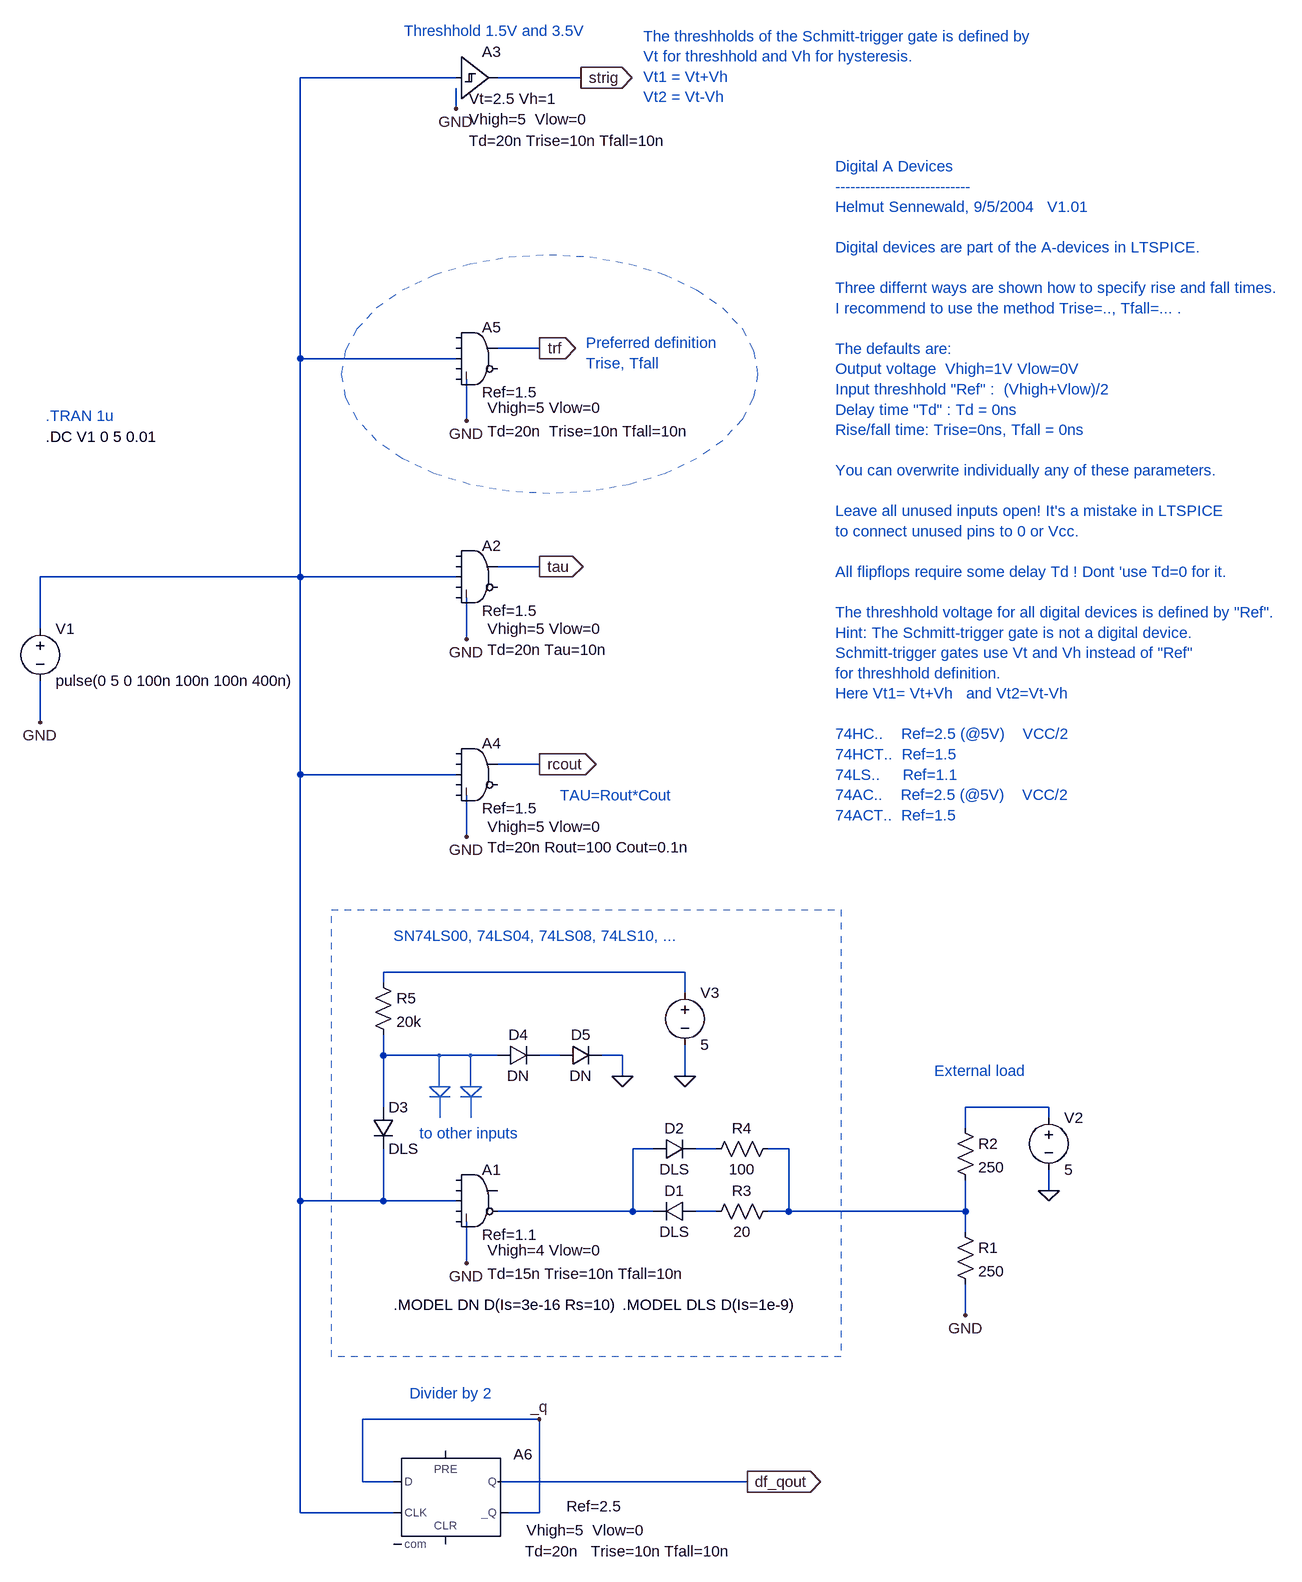
[diagram p0: schematic DIGITAL_A_DEVICES_1.asc]
DIGITAL_A_DEVICES_1.asc, the LTspice schematic file:
Version 4
SHEET 1 3000 2120
WIRE 1632 1584 1632 1648
WIRE 1680 1568 1888 1568
WIRE 976 816 976 752
WIRE 976 672 976 592
WIRE 1376 1552 1504 1552
WIRE 2400 1568 2400 1600
WIRE 2400 1680 2400 1728
WIRE 1632 624 1632 688
WIRE 1680 576 1744 576
WIRE 1616 592 1376 592
WIRE 1376 592 1376 896
WIRE 1376 592 1376 256
WIRE 1376 -176 1616 -176
WIRE 1680 -176 1808 -176
WIRE 1616 -160 1616 -128
WIRE 2528 1504 2528 1536
WIRE 2528 1424 2528 1408
WIRE 2528 1408 2400 1408
WIRE 2400 1408 2400 1440
WIRE 2400 1520 2400 1568
WIRE 1632 928 1632 992
WIRE 1680 880 1744 880
WIRE 1616 896 1376 896
WIRE 1376 896 1376 1552
WIRE 1632 288 1632 352
WIRE 1680 240 1744 240
WIRE 1376 256 1616 256
WIRE 1376 256 1376 -176
WIRE 2096 1568 2128 1568
WIRE 1984 1568 2016 1568
WIRE 1984 1472 2016 1472
WIRE 2128 1472 2128 1568
WIRE 2128 1568 2400 1568
WIRE 2096 1472 2128 1472
WIRE 1920 1472 1888 1472
WIRE 1888 1472 1888 1568
WIRE 1888 1568 1920 1568
WIRE 1376 592 976 592
WIRE 1504 1472 1504 1552
WIRE 1504 1552 1616 1552
WIRE 1504 1408 1504 1328
WIRE 1504 1216 1504 1200
WIRE 1968 1200 1968 1232
WIRE 1968 1312 1968 1360
WIRE 1504 1200 1968 1200
WIRE 1520 2032 1376 2032
WIRE 1376 2032 1376 1552
WIRE 1520 1984 1472 1984
WIRE 1472 1984 1472 1888
WIRE 1472 1888 1744 1888
WIRE 1744 1888 1744 2032
WIRE 1680 1984 2064 1984
WIRE 1744 2032 1696 2032
WIRE 1840 1328 1872 1328
WIRE 1776 1328 1744 1328
WIRE 1680 1328 1504 1328
WIRE 1504 1328 1504 1296
WIRE 1872 1328 1872 1360
FLAG 1632 1648 GND
FLAG 976 816 GND
FLAG 2400 1728 GND
FLAG 1632 688 GND
FLAG 1616 -128 GND
FLAG 2528 1536 0
FLAG 1632 992 GND
FLAG 1744 576 tau
IOPIN 1744 576 Out
FLAG 1744 880 rcout
IOPIN 1744 880 Out
FLAG 1632 352 GND
FLAG 1744 240 trf
IOPIN 1744 240 Out
FLAG 1808 -176 strig
IOPIN 1808 -176 Out
FLAG 1968 1360 0
FLAG 2064 1984 df_qout
IOPIN 2064 1984 Out
FLAG 1744 1888 _q
FLAG 1872 1360 0
SYMBOL digital\\and 1648 1488 R0
WINDOW 39 16 176 Left 0
WINDOW 123 16 140 Left 0
SYMATTR SpiceLine Td=15n Trise=10n Tfall=10n
SYMATTR Value2 Vhigh=4 Vlow=0
SYMATTR InstName A1
SYMATTR Value Ref=1.1
SYMATTR SpiceLine2 tripdt=5n
SYMBOL voltage 976 656 R0
SYMATTR InstName V1
SYMATTR Value pulse(0 5 0 100n 100n 100n 400n)
SYMBOL res 2384 1584 R0
SYMATTR InstName R1
SYMATTR Value 250
SYMBOL digital\\and 1648 528 R0
WINDOW 39 16 176 Left 0
WINDOW 123 16 144 Left 0
SYMATTR SpiceLine Td=20n Tau=10n
SYMATTR Value2 Vhigh=5 Vlow=0
SYMATTR SpiceLine2 tripdt=5n
SYMATTR InstName A2
SYMATTR Value Ref=1.5
SYMBOL digital\\schmtbuf 1616 -240 R0
WINDOW 3 20 96 Left 0
WINDOW 123 20 128 Left 0
WINDOW 39 20 161 Left 0
SYMATTR Value Vt=2.5 Vh=1
SYMATTR Value2 Vhigh=5  Vlow=0
SYMATTR SpiceLine Td=20n Trise=10n Tfall=10n
SYMATTR InstName A3
SYMATTR SpiceLine2 tripdt=5n
SYMBOL voltage 2528 1408 R0
SYMATTR InstName V2
SYMATTR Value 5
SYMBOL res 2384 1424 R0
SYMATTR InstName R2
SYMATTR Value 250
SYMBOL digital\\and 1648 832 R0
WINDOW 39 16 176 Left 0
WINDOW 123 16 144 Left 0
SYMATTR SpiceLine Td=20n Rout=100 Cout=0.1n
SYMATTR Value2 Vhigh=5 Vlow=0
SYMATTR SpiceLine2 tripdt=5n
SYMATTR InstName A4
SYMATTR Value Ref=1.5
SYMBOL digital\\and 1648 192 R0
WINDOW 39 16 176 Left 0
WINDOW 123 16 140 Left 0
SYMATTR SpiceLine Td=20n  Trise=10n Tfall=10n
SYMATTR Value2 Vhigh=5 Vlow=0
SYMATTR InstName A5
SYMATTR Value Ref=1.5
SYMATTR SpiceLine2 tripdt=5n
SYMBOL res 2000 1584 R270
WINDOW 0 32 56 VTop 0
WINDOW 3 0 56 VBottom 0
SYMATTR InstName R3
SYMATTR Value 20
SYMBOL diode 1984 1552 R90
WINDOW 0 0 32 VBottom 0
WINDOW 3 32 32 VTop 0
SYMATTR InstName D1
SYMATTR Value DLS
SYMBOL diode 1920 1488 R270
WINDOW 0 32 32 VTop 0
WINDOW 3 0 32 VBottom 0
SYMATTR InstName D2
SYMATTR Value DLS
SYMBOL res 2000 1488 R270
WINDOW 0 32 56 VTop 0
WINDOW 3 0 56 VBottom 0
SYMATTR InstName R4
SYMATTR Value 100
SYMBOL voltage 1968 1216 R0
SYMATTR InstName V3
SYMATTR Value 5
SYMBOL diode 1488 1408 R0
SYMATTR InstName D3
SYMATTR Value DLS
SYMBOL Digital\\dflop 1600 1936 R0
WINDOW 3 186 86 Left 0
WINDOW 123 124 123 Left 0
WINDOW 39 122 155 Left 0
SYMATTR Value Ref=2.5
SYMATTR Value2 Vhigh=5  Vlow=0
SYMATTR SpiceLine Td=20n   Trise=10n Tfall=10n
SYMATTR InstName A6
SYMATTR SpiceLine2 tripdt=5n
SYMBOL res 1488 1200 R0
SYMATTR InstName R5
SYMATTR Value 20k
SYMBOL diode 1680 1344 R270
WINDOW 0 32 32 VTop 0
WINDOW 3 0 32 VBottom 0
SYMATTR InstName D4
SYMATTR Value DN
SYMBOL diode 1776 1344 R270
WINDOW 0 32 32 VTop 0
WINDOW 3 0 32 VBottom 0
SYMATTR InstName D5
SYMATTR Value DN
TEXT 984 344 Left 0 ;.TRAN 1u
TEXT 1776 928 Left 0 ;TAU=Rout*Cout
TEXT 1536 -248 Left 0 ;Threshhold 1.5V and 3.5V
TEXT 1872 1712 Left 0 !.MODEL DLS D(Is=1e-9)
TEXT 1520 1144 Left 0 ;SN74LS00, 74LS04, 74LS08, 74LS10, ...
TEXT 1816 232 Left 0 ;Preferred definition\nTrise, Tfall
TEXT 1904 -240 Left 0 ;The threshholds of the Schmitt-trigger gate is defined by \nVt for threshhold and Vh for hysteresis.\nVt1 = Vt+Vh\nVt2 = Vt-Vh
TEXT 2352 1352 Left 0 ;External load
TEXT 2200 -40 Left 0 ;Digital A Devices\n---------------------------\nHelmut Sennewald, 9/5/2004   V1.01\n \nDigital devices are part of the A-devices in LTSPICE.\n \nThree differnt ways are shown how to specify rise and fall times.\nI recommend to use the method Trise=.., Tfall=... .\n \nThe defaults are:\nOutput voltage  Vhigh=1V Vlow=0V\nInput threshhold "Ref" :  (Vhigh+Vlow)/2\nDelay time "Td" : Td = 0ns\nRise/fall time: Trise=0ns, Tfall = 0ns\n \nYou can overwrite individually any of these parameters.\n \nLeave all unused inputs open! It's a mistake in LTSPICE \nto connect unused pins to 0 or Vcc.\n \nAll flipflops require some delay Td ! Dont 'use Td=0 for it.\n \nThe threshhold voltage for all digital devices is defined by "Ref".\nHint: The Schmitt-trigger gate is not a digital device.\nSchmitt-trigger gates use Vt and Vh instead of "Ref" \nfor threshhold definition.\nHere Vt1= Vt+Vh   and Vt2=Vt-Vh\n \n74HC..    Ref=2.5 (@5V)    VCC/2  \n74HCT..  Ref=1.5\n74LS..     Ref=1.1\n74AC..    Ref=2.5 (@5V)    VCC/2\n74ACT..  Ref=1.5
TEXT 1544 1848 Left 0 ;Divider by 2
TEXT 1560 1448 Left 0 ;to other inputs
TEXT 984 376 Left 0 !.DC V1 0 5 0.01
TEXT 1520 1712 Left 0 !.MODEL DN D(Is=3e-16 Rs=10)
LINE Normal 1607 1376 1575 1376
LINE Normal 1591 1392 1607 1376
LINE Normal 1575 1376 1591 1392
LINE Normal 1575 1376 1575 1376
LINE Normal 1607 1392 1575 1392
LINE Normal 1590 1376 1590 1328
LINE Normal 1591 1424 1591 1392
LINE Normal 1655 1376 1623 1376
LINE Normal 1639 1392 1655 1376
LINE Normal 1623 1376 1639 1392
LINE Normal 1623 1376 1623 1376
LINE Normal 1655 1392 1623 1392
LINE Normal 1638 1376 1638 1328
LINE Normal 1639 1424 1639 1392
RECTANGLE Normal 2208 1792 1424 1104 2
CIRCLE Normal 2080 464 1440 96 2
CIRCLE Normal 1590 1328 1590 1328
CIRCLE Normal 1592 1326 1588 1330
CIRCLE Normal 1638 1328 1638 1328
CIRCLE Normal 1640 1326 1636 1330

The netlist it stands for:
* DIGITAL_A_DEVICES_1.asc
A1 GND GND N002 GND GND N001 GND GND AND Ref=1.1 Vhigh=4 Vlow=0 Td=15n Trise=10n Tfall=10n tripdt=5n
V1 N002 GND pulse(0 5 0 100n 100n 100n 400n)
R1 N003 GND 250
A2 GND GND N002 GND GND GND tau GND AND Ref=1.5 Vhigh=5 Vlow=0 Td=20n Tau=10n tripdt=5n
A3 N002 GND GND GND GND GND strig GND SCHMITT Vt=2.5 Vh=1 Vhigh=5  Vlow=0 Td=20n Trise=10n Tfall=10n tripdt=5n
V2 N004 0 5
R2 N004 N003 250
A4 GND GND N002 GND GND GND rcout GND AND Ref=1.5 Vhigh=5 Vlow=0 Td=20n Rout=100 Cout=0.1n tripdt=5n
A5 GND GND N002 GND GND GND trf GND AND Ref=1.5 Vhigh=5 Vlow=0 Td=20n  Trise=10n Tfall=10n tripdt=5n
R3 N005 N003 20
D1 N005 N001 DLS
D2 N001 N006 DLS
R4 N006 N003 100
V3 N008 0 5
D3 N007 N002 DLS
A6 _q 0 N002 0 0 _q df_qout 0 DFLOP Ref=2.5 Vhigh=5  Vlow=0 Td=20n   Trise=10n Tfall=10n tripdt=5n
R5 N008 N007 20k
D4 N007 N009 DN
D5 N009 0 DN
.model D D
.lib standard.dio
* .TRAN 1u
* TAU=Rout*Cout
* Threshhold 1.5V and 3.5V
.MODEL DLS D(Is=1e-9)
* SN74LS00, 74LS04, 74LS08, 74LS10, ...
* Preferred definition
* Trise, Tfall
* The threshholds of the Schmitt-trigger gate is defined by
* Vt for threshhold and Vh for hysteresis.
* Vt1 = Vt+Vh
* Vt2 = Vt-Vh
* External load
* Digital A Devices
* ---------------------------
* Helmut Sennewald, 9/5/2004   V1.01
* Digital devices are part of the A-devices in LTSPICE.
* Three differnt ways are shown how to specify rise and fall times.
* I recommend to use the method Trise=.., Tfall=... .
* The defaults are:
* Output voltage  Vhigh=1V Vlow=0V
* Input threshhold "Ref" :  (Vhigh+Vlow)/2
* Delay time "Td" : Td = 0ns
* Rise/fall time: Trise=0ns, Tfall = 0ns
* You can overwrite individually any of these parameters.
* Leave all unused inputs open! It's a mistake in LTSPICE
* to connect unused pins to 0 or Vcc.
* All flipflops require some delay Td ! Dont 'use Td=0 for it.
* The threshhold voltage for all digital devices is defined by "Ref".
* Hint: The Schmitt-trigger gate is not a digital device.
* Schmitt-trigger gates use Vt and Vh instead of "Ref"
* for threshhold definition.
* Here Vt1= Vt+Vh   and Vt2=Vt-Vh
* 74HC..    Ref=2.5 (@5V)    VCC/2
* 74HCT..  Ref=1.5
* 74LS..     Ref=1.1
* 74AC..    Ref=2.5 (@5V)    VCC/2
* 74ACT..  Ref=1.5
* Divider by 2
* to other inputs
.DC V1 0 5 0.01
.MODEL DN D(Is=3e-16 Rs=10)
.backanno
.end